# Altium schematic sheet encoder.SchDoc: Encoder
size A3; DrawnBy: Mogens Groth Nicolaisen; DocumentNumber: 7; SheetNumber: 7; SheetTotal: 7
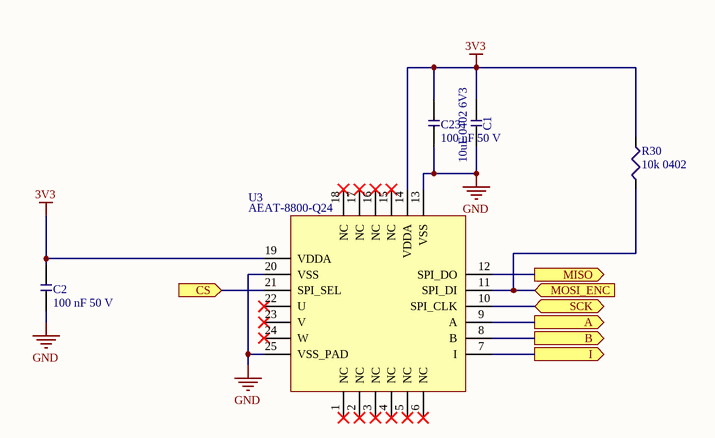
[diagram p0: encoder.SchDoc]

## Parts
C1  10uF 0402 6V3  [CAP_0402]
C2  100 nF 50 V  [CAP_0402]
C23  100 nF 50 V  [CAP_0402]
R30  10k 0402  [RES_0402]
U3  AEAT-8800-Q24  [AEAT-8800-Q24]

## Ports
A (out), B (out), CS (in), I (out), MISO (out), MOSI_ENC (in), SCK (bidir)

## Nets
3V3: C1.2 C2.1 C23.1 R30.2 U3.14(VDDA) U3.19(VDDA)
GND: C1.1 C2.2 C23.2 U3.13(VSS) U3.20(VSS) U3.25(VSS_PAD)
A: U3.9(A) ; port A
B: U3.8(B) ; port B
CS: U3.21(SPI_SEL) ; port CS
I: U3.7(I) ; port I
MISO: U3.12(SPI_DO) ; port MISO
MOSI_ENC: R30.1 U3.11(SPI_DI) ; port MOSI_ENC
SCK: U3.10(SPI_CLK) ; port SCK

Not connected (* = marked no-connect by the designer): U3 1(NC)* 2(NC)* 3(NC)* 4(NC)* 5(NC)* 6(NC)* 15(NC)* 16(NC)* 17(NC)* 18(NC)* 22(U)* 23(V)* 24(W)*

## Notes on the sheet
- ON Development
- Title:
- Size:
- A3
- Drawn By:
- Date:
- Sheet
- of
- Revision:

## Library data of the parts
C1 = CMP-00011-3: 10uF 20% 0402 6V3 X6S; Current Rating: -; Tolerance: 20%; Value: 10uF; Voltage: 6V3
C2 C23 = CMP-00088-2: Multilayer Ceramic Capacitors MLCC - SMD/SMT .1uF 50Volts X7R +/-10% 0402 STD; Tolerance: 10%; Value: 100nF; Voltage: 50 V; Voltage Rating (DC): 50V; Capacitance: 100nF; Case/Package: 0402; Case Code (Imperial): 0402; Case Code (Metric): 1005; Dielectric: X7R; Halogen Free: Halogen Free; Height: 0.5mm; Lead Free: Lead Free; Length: 0.039inch; Max Operating Temperature: 125°C; Min Operating Temperature: -55°C; Mount: Surface Mount; Package Quantity: 10000; Packaging: Tape and Reel; Termination: SMD/SMT; Thickness: 0.022inch; Voltage Rating: 50V; Width: 0.5mm
R30 = CMP-001-0019-3: RES SMD 10K OHM 1% 1/16W 0402; Mfg. Part Number: RMCF0402FT10K0; Case/Package: 0402; Power: 1/16 W; Tolerance: 1 %; Value: 10k
U3 = CMP-00040-3: 16-BIT PROG ANG ENCODER; Mfg. Part Number: AEAT-8800-Q24